# EAGLE design A704E (EAGLE 6.6.0)
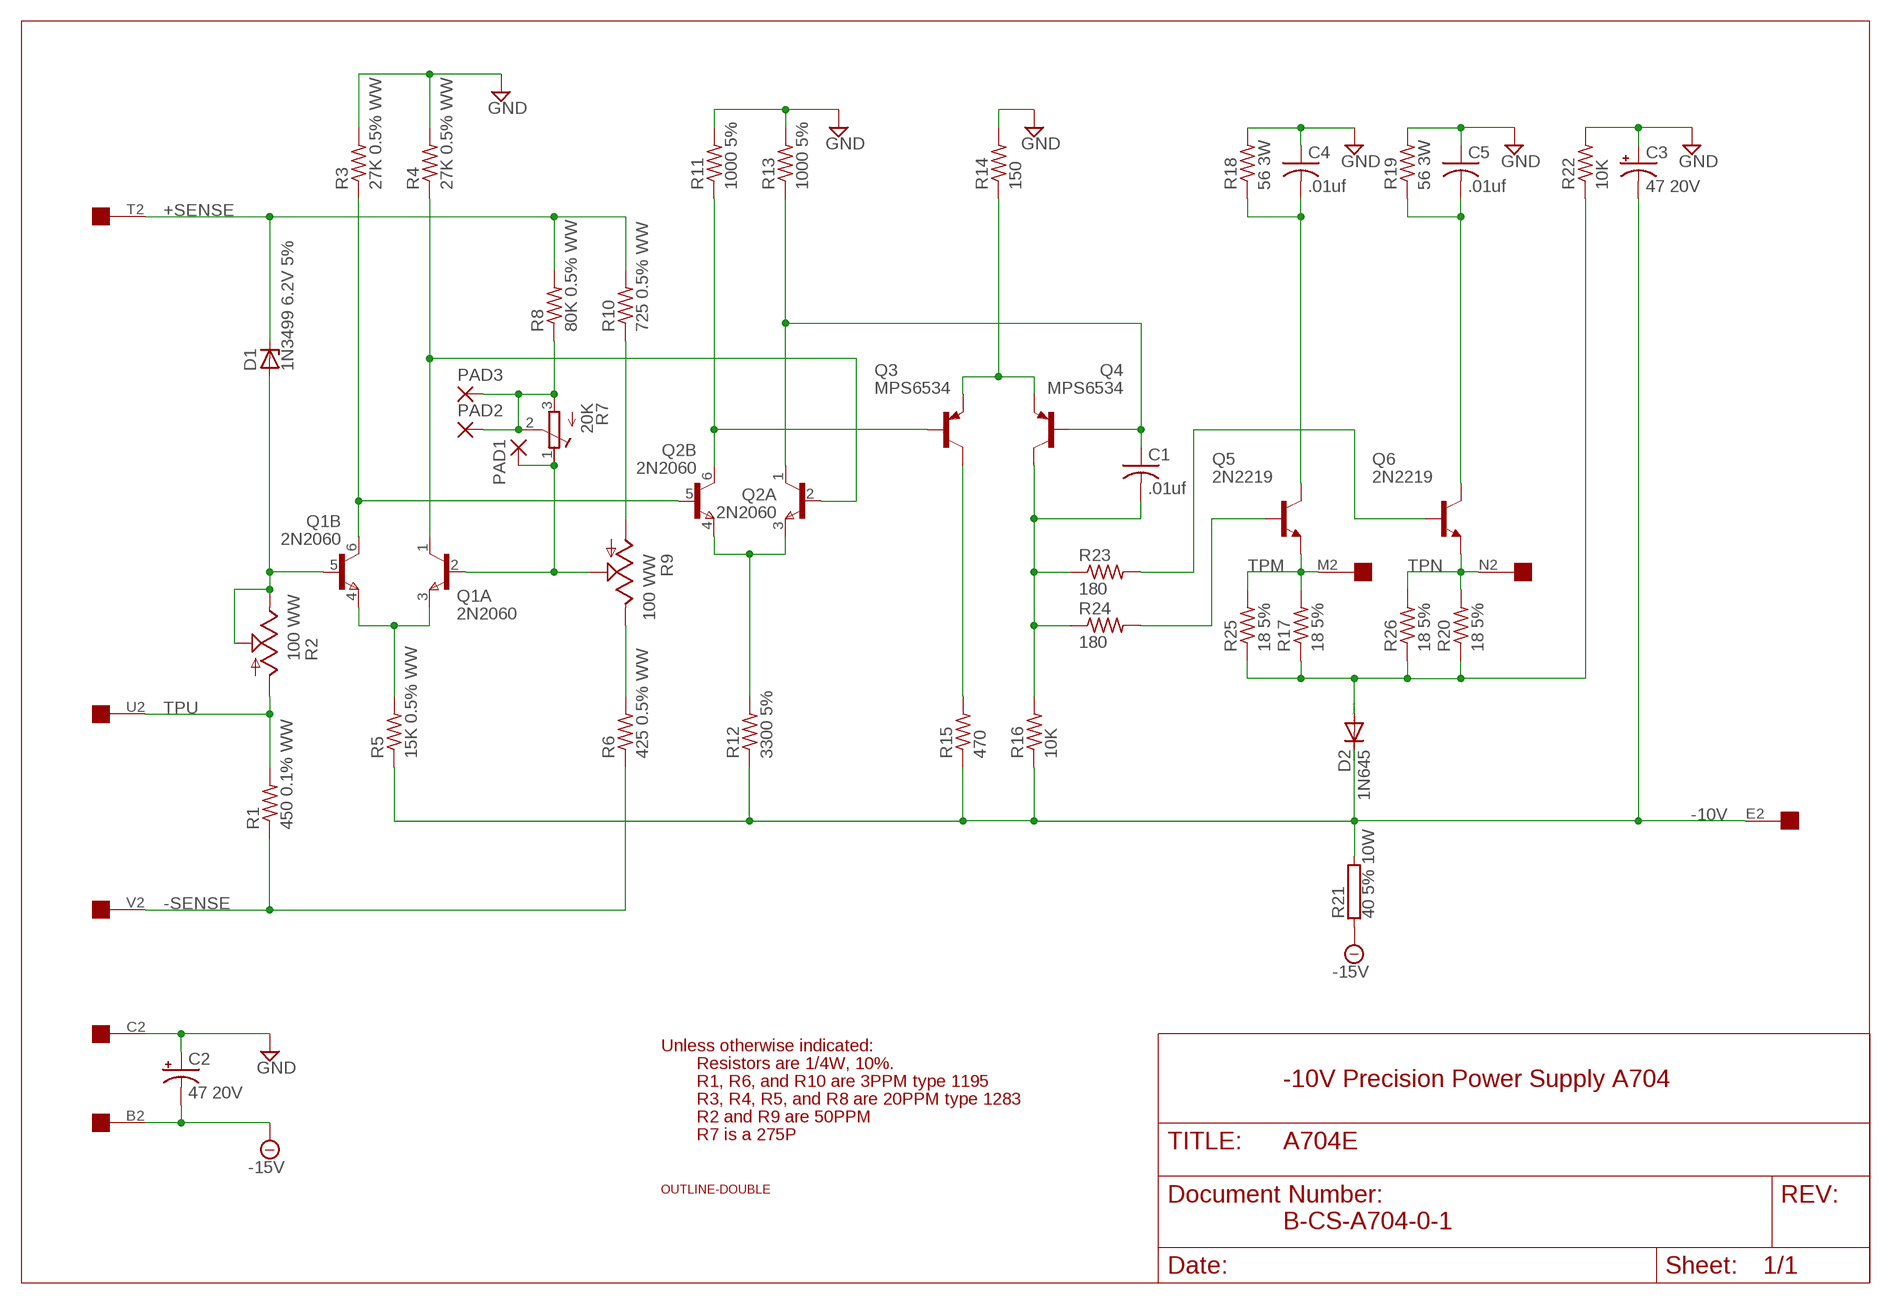
[diagram p0: schematic, sheet 1]

## Parts
C1  .01uf  C-US050-025X075  [C050-025X075]
C2  47 20V  CPOL-USE22-6AXIAL  [E22-6]
C3  47 20V  CPOL-USE22-6AXIAL  [E22-6]
C4  .01uf  C-US050-025X075  [C050-025X075]
C5  .01uf  C-US050-025X075  [C050-025X075]
D1  1N3499 6.2V 5%  ZENER-DIODEDO35Z10  [DO35Z10]
D2  1N645  1N4148DO35-10  [DO35-10]
PAD1  2,54/1,0  [2,54/1,0]
PAD2  2,54/1,0  [2,54/1,0]
PAD3  2,54/1,0  [2,54/1,0]
Q1  2N2060  MAT-02H  [TO78]
Q2  2N2060  MAT-02H  [TO78]
Q3  MPS6534  2N2904A  [TO39]
Q4  MPS6534  2N2904A  [TO39]
Q5  2N2219  2N1613-NPN-TO39-EBC  [TO39]
Q6  2N2219  2N1613-NPN-TO39-EBC  [TO39]
R1  450 0.1% WW  R-US_0817/22  [P0817/22]
R2  100 WW  TRIM_US-S75P  [S75P]
R3  27K 0.5% WW  R-US_0411/15  [0411/15]
R4  27K 0.5% WW  R-US_0411/15  [0411/15]
R5  15K 0.5% WW  R-US_0411/15  [0411/15]
R6  425 0.5% WW  R-US_0817/22  [P0817/22]
R7  20K  275P  [3006Y]
R8  80K 0.5% WW  R-US_0411/15  [0411/15]
R9  100 WW  TRIM_US-S75P  [S75P]
R10  725 0.5% WW  R-US_0817/22  [P0817/22]
R11  1000 5%  R-US_0207/10  [0207/10]
R12  3300 5%  R-US_0207/10  [0207/10]
R13  1000 5%  R-US_0207/10  [0207/10]
R14  150  R-US_0207/10  [0207/10]
R15  470  R-US_0207/10  [0207/10]
R16  10K  R-US_0207/10  [0207/10]
R17  18 5%  R-US_0207/10  [0207/10]
R18  56 3W  R-US_0411/15  [0411/15]
R19  56 3W  R-US_0411/15  [0411/15]
R20  18 5%  R-US_0207/10  [0207/10]
R21  40 5% 10W  RKH216-8  [KH216-8]
R22  10K  R-US_0207/10  [0207/10]
R23  180  R-US_0207/10  [0207/10]
R24  180  R-US_0207/10  [0207/10]
R25  18 5%  R-US_0207/10  [0207/10]
R26  18 5%  R-US_0207/10  [0207/10]
U$2  OUTLINE-DOUBLE  [DOUBLE]
U$3  EDGE-1  [EDGE-CON1]

## Nets
+SENSE: D1.C R8.2 R10.2 U$3.T2
-10V: C3.- D2.C R5.1 R12.1 R15.1 R16.1 R21.2 U$3.E2
-15V [supply]: C2.- R21.1 U$3.B2
-SENSE: R1.1 R6.1 U$3.V2
GND [supply]: C2.+ C3.+ C4.1 C5.1 R3.2 R4.2 R11.2 R13.2 R14.2 R18.2 R19.2 R22.2 U$3.C2
N$1: Q1.3(A:E) Q1.4(B:E) R5.2
N$2: Q1.1(A:C) Q2.2(A:B) R4.1
N$3: Q1.6(B:C) Q2.5(B:B) R3.1
N$4: D1.A Q1.5(B:B) R2.E R2.S
N$5: R6.2 R9.E
N$6: Q2.3(A:E) Q2.4(B:E) R12.2
N$7: Q2.6(B:C) Q3.2(B) R11.1
N$8: PAD1.1(P) Q1.2(A:B) R7.1(A) R9.S
N$10: C1.1 Q2.1(A:C) Q4.2(B) R13.1
N$11: Q3.3(C) R15.2
N$12: C1.2 Q4.3(C) R16.2 R23.1 R24.1
N$13: PAD2.1(P) PAD3.1(P) R7.2(S) R7.3(E) R8.1
N$15: D2.A R17.1 R20.1 R22.1 R25.1 R26.1
N$17: Q3.1(E) Q4.1(E) R14.1
N$18: Q5.2(B) R24.2
N$19: Q6.2(B) R23.2
N$20: C4.2 Q5.3(C) R18.1
N$21: C5.2 Q6.3(C) R19.1
N$22: R9.A R10.1
TPM: Q5.1(E) R17.2 R25.2 U$3.M2
TPN: Q6.1(E) R20.2 R26.2 U$3.N2
TPU: R1.2 R2.A U$3.U2
Unconnected: U$3.A2 U$3.D2 U$3.F2 U$3.H2 U$3.J2 U$3.K2 U$3.L2 U$3.P2 U$3.R2 U$3.S2

## Notes on the sheet
- Unless otherwise indicated:
- Resistors are 1/4W, 10%.
- R1, R6, and R10 are 3PPM type 1195 | -10V Precision Power Supply A704
- R3, R4, R5, and R8 are 20PPM type 1283
- R2 and R9 are 50PPM
- R7 is a 275P
- B-CS-A704-0-1

## Library data of the parts
C1 C4 C5 = rcl:C-US: CAPACITOR, American symbol
C2 C3 = rcl:CPOL-US: POLARIZED CAPACITOR, American symbol
D1 = diode:ZENER-DIODE: Z-Diode
D2 = diode:1N4148: DIODE high speed (Philips)
PAD1-PAD3 = wirepad:2,54/1,0: THROUGH-HOLE PAD
Q1 Q2 = linear:MAT-02H: Dual TRANSISTOR
Q3 Q4 = transistor-pnp:2N2904*: PNP Transistror
Q5 Q6 = transistor:*-NPN-: NPN Transistror BF959 corrected 2008.03.06
R1 R3-R6 R8 R10-R20 R22-R26 = rcl:R-US_: RESISTOR, American symbol
R2 R9 = pot:TRIM_US-: POTENTIOMETER
R7 = dec-con:275P: Trimpot with 275P (3006Y) footprint.
R21 = resistor-power:R: Power Resitor; OC_FARNELL: unknown; OC_NEWARK: unknown
U$2 = dec-con:OUTLINE-*: Board outlines for DEC boards.
U$3 = dec-con:EDGE-1: Single-Sided DEC Edge Connector -- (side 2)

## Net classes
1 supply: width 0.813 mm

## Board
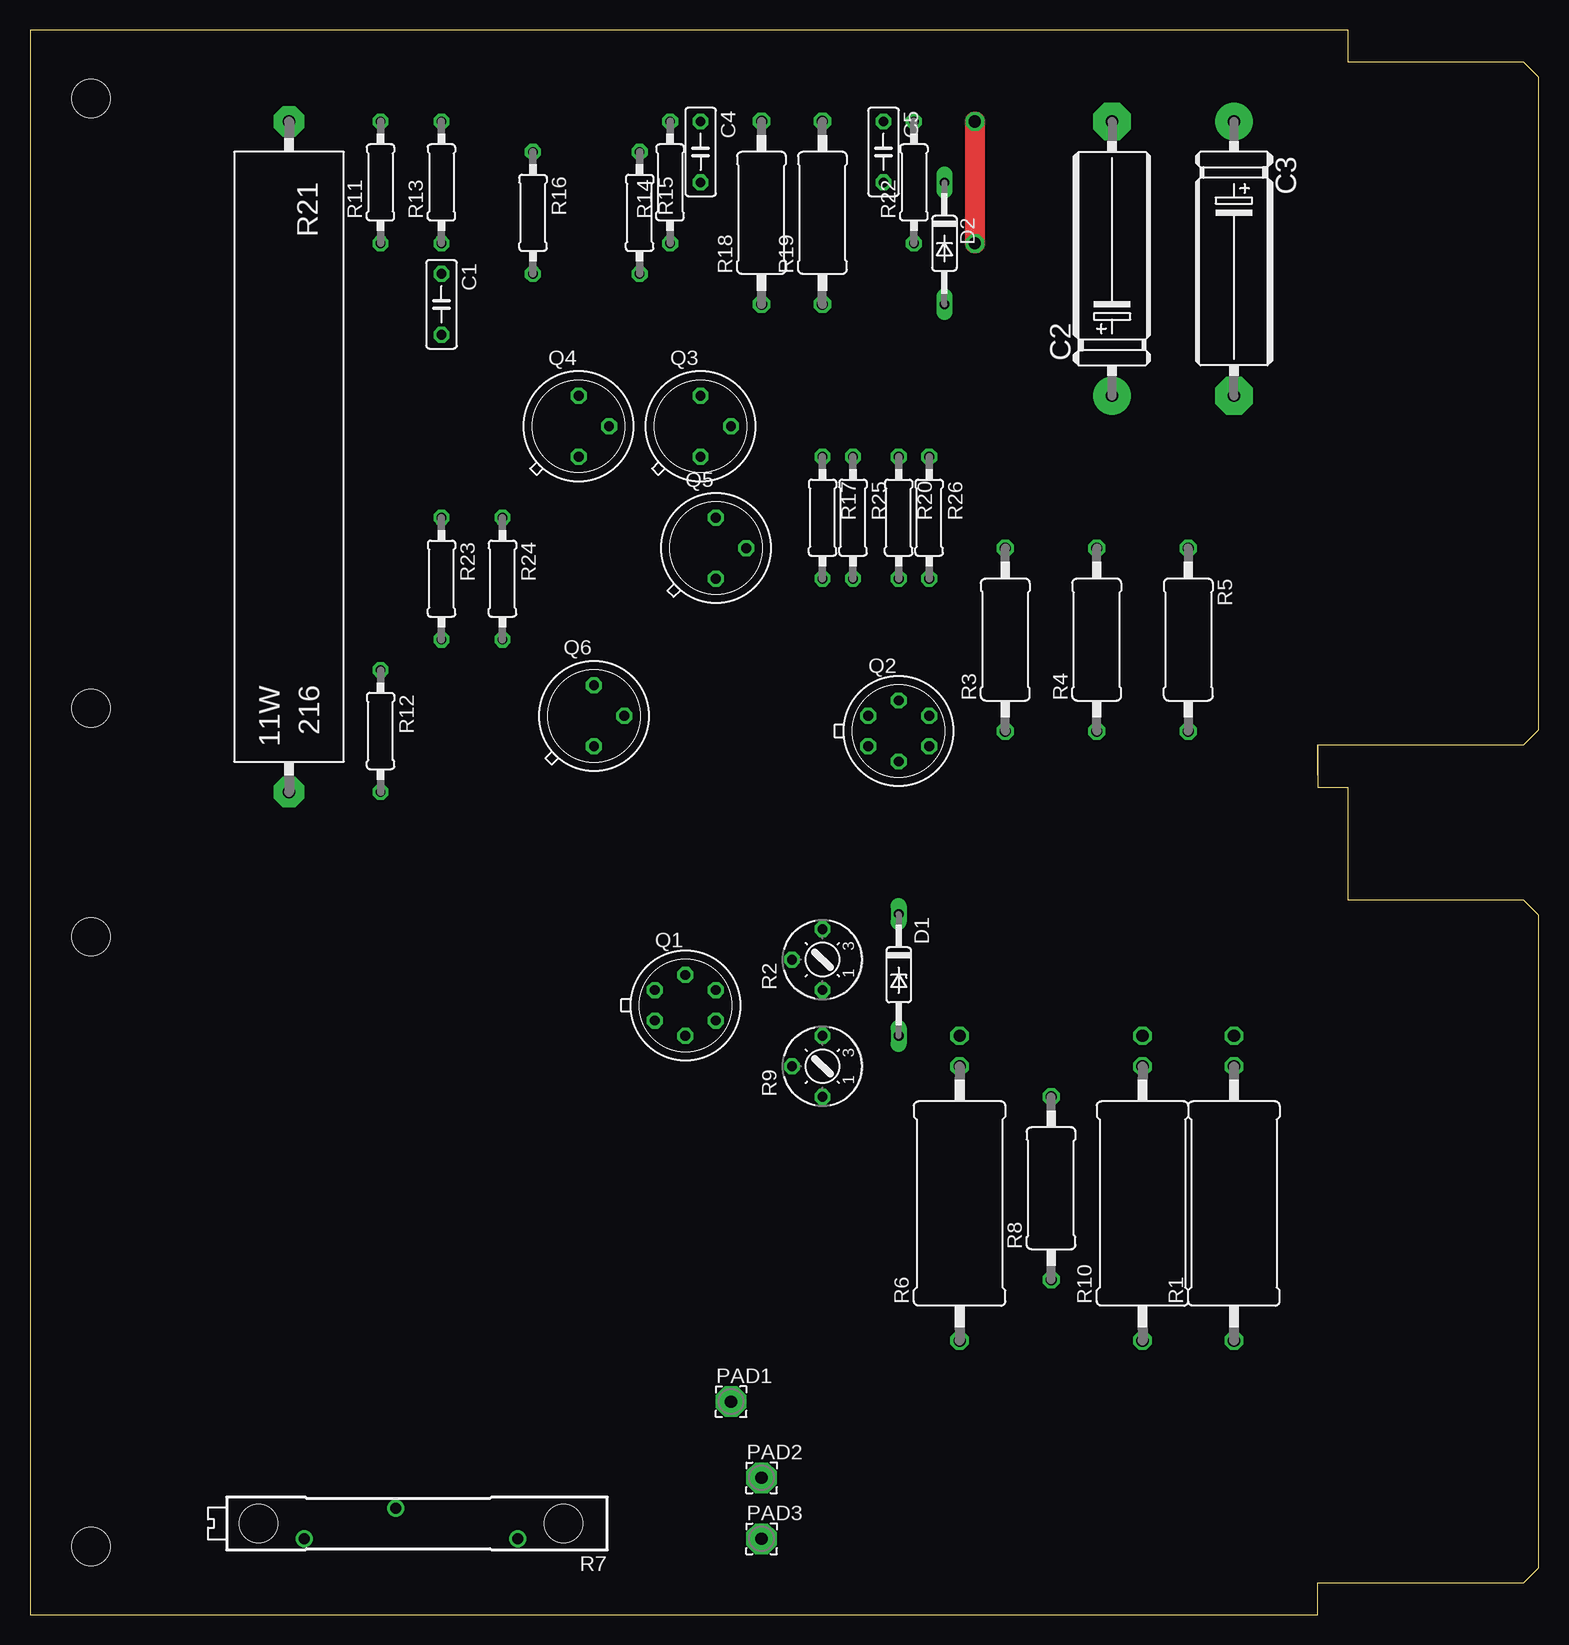
[diagram p1: board, top side]
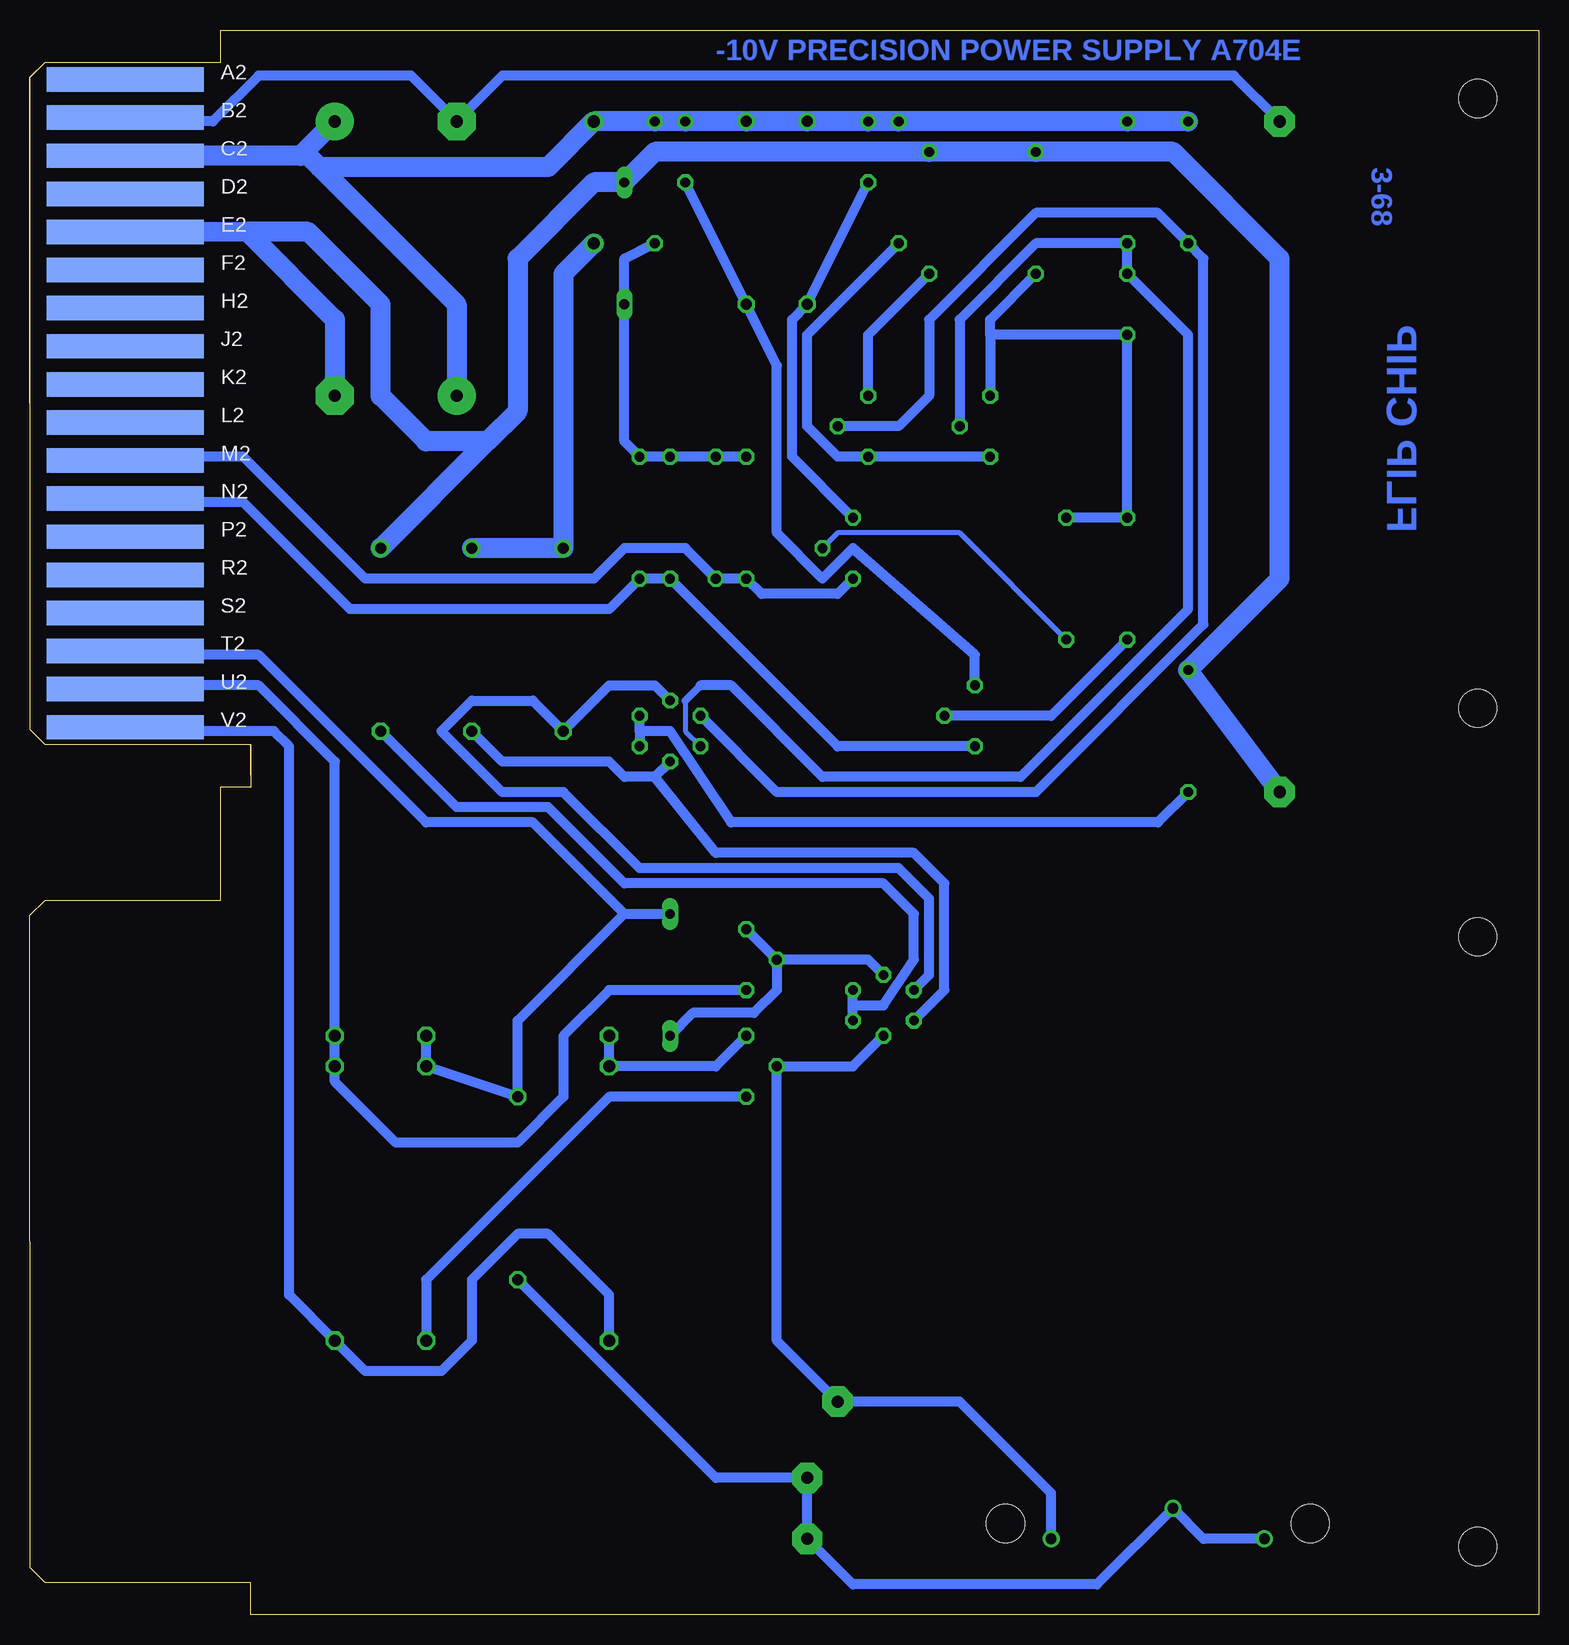
[diagram p2: board, bottom side, seen from below]

Size 125.73 x 132.08 mm. Coordinates in mm from the lower left corner, seen from the top.
Copper layers (1+16): Top 0.035mm / dielectric 1.5mm / Bottom 0.035mm
Design rules "16mils": minimum track width 16mil, minimum drill 32mil, track to track 15mil, track to pad 10mil, pad to pad 10mil, via to via 10mil, smd to smd 10mil, copper to edge 13mil, drill to drill 10mil, minimum pad ring 10mil, minimum via ring 8mil, stop-mask expansion 0mil, vias tented up to drill 0mil, thermal gap 10mil
Holes 3.17 mm at 19.05,7.62 44.45,7.62

### Footprints (pad centres in the part's own frame; a part is rotated, then mirrored left to right if it is on the bottom)
C050-025X075 = drill 0.813 octagon: 1 -2.54,0; 2 2.54,0
E22-6 = drill 1.016 pad 3.15: + -11.43,0 | drill 1.016 pad 3.15 octagon: - 11.43,0
DO35Z10 = drill 0.813 long: A 5.08,0; C -5.08,0
DO35-10 = drill 0.813 long: A 5.08,0; C -5.08,0
2,54/1,0 = drill 1.016 pad 2.54 octagon: 1 0,0
TO78 = drill 0.813 octagon: 1 -2.54,-1.27; 2 0,-2.54; 3 2.54,-1.27; 4 2.54,1.27; 5 0,2.54; 6 -2.54,1.27
TO39 = drill 0.813 octagon: 1 0,-2.54; 2 2.54,0; 3 0,2.54
P0817/22 = drill 1.016 octagon: 1 -11.43,0; 2 11.43,0
S75P = drill 0.813 octagon: A -2.54,0; E 2.54,0; S 0,2.54
0411/15 = drill 0.914 octagon: 1 -7.62,0; 2 7.62,0
3006Y = drill 0.9: 1 -8.89,1.27; 2 1.27,-1.27; 3 8.89,1.27
0207/10 = drill 0.813 octagon: 1 -5.08,0; 2 5.08,0
KH216-8 = drill 1.016 pad 2.54 octagon: 1 -27.94,0; 2 27.94,0
DOUBLE = hole 3.175: 120.65,56.515; 120.65,5.715; 120.65,75.565; 120.65,126.365
EDGE-CON1 = smd 13.106 x 2.032 bottom: A2 7.938,4.128; B2 7.938,7.303; C2 7.938,10.477; D2 7.938,13.652; E2 7.938,16.828; F2 7.938,20.003; H2 7.938,23.177; J2 7.938,26.352; K2 7.938,29.527; L2 7.938,32.703; M2 7.938,35.877; N2 7.938,39.053; P2 7.938,42.227; R2 7.938,45.403; S2 7.938,48.578; T2 7.938,51.752; U2 7.938,54.928; V2 7.938,58.102

### Placement (x,y rotation side)
C1  34.29,109.22 270 top
C2  90.17,113.03 90 top
C3  100.33,113.03 270 top
C4  55.88,121.92 270 top
C5  71.12,121.92 270 top
D1  72.39,53.34 270 top
D2  76.2,114.3 270 top
PAD1  58.42,17.78 0 top
PAD2  60.96,11.43 0 top
PAD3  60.96,6.35 0 top
Q1  54.61,50.8 0 top
Q2  72.39,73.66 0 top
Q3  55.88,99.06 0 top
Q4  45.72,99.06 0 top
Q5  57.15,88.9 0 top
Q6  46.99,74.93 0 top
R1  100.33,34.29 90 top
R2  66.04,54.61 90 top
R3  81.28,81.28 90 top
R4  88.9,81.28 90 top
R5  96.52,81.28 270 top
R6  77.47,34.29 90 top
R7  31.75,7.62 180 top
R8  85.09,35.56 90 top
R9  66.04,45.72 90 top
R10  92.71,34.29 90 top
R11  29.21,119.38 90 top
R12  29.21,73.66 270 top
R13  34.29,119.38 90 top
R14  53.34,119.38 90 top
R15  50.8,116.84 270 top
R16  41.91,116.84 270 top
R17  66.04,91.44 270 top
R18  60.96,116.84 90 top
R19  66.04,116.84 90 top
R20  72.39,91.44 270 top
R21  21.59,96.52 270 top
R22  73.66,119.38 90 top
R23  34.29,86.36 270 top
R24  39.37,86.36 270 top
R25  68.58,91.44 270 top
R26  74.93,91.44 270 top
U$2  125.73,132.08 180 top
U$3  125.73,132.08 180 top

### Tracks (layer width: path | path; a pad name or v marks a point on that pad's centre or on a via)
+SENSE  (via drill 1.02)
  Bottom 0.813: v92.71,48.26 R10.2 R8.2 85.09,49.53 76.2,58.42 | 76.2,58.42 D1.C | U$3.T2 115.9,80.34 115.57,80.01 106.68,80.01 92.71,66.04 83.82,66.04 76.2,58.42
-10V
  Bottom 1.676: U$3.E2 107.62,115.24 107.63,115.25 | 107.63,115.25 100.33,107.95 C3.- | 107.63,115.25 102.55,115.25 96.52,109.22 96.52,101.6 92.71,97.79 87.63,97.79 | 87.63,97.79 85.09,100.33 85.09,113.03 78.74,119.38 D2.C 73.66,121.92 R15.1 R16.1 30.48,121.92 21.59,113.03 21.59,86.36 R12.1 R21.2 | 87.63,97.79 R5.1
-15V
  Bottom 0.813: U$3.B2 116.84,124.75 116.84,124.46 110.49,124.46 106.68,128.27 93.98,128.27 C2.- 86.36,128.27 25.4,128.27 R21.1
-SENSE
  Bottom 0.813: U$3.V2 117.16,73.98 116.84,73.66 105.41,73.66 104.14,72.39 104.14,26.67 R1.1 97.79,20.32 91.44,20.32 88.9,22.86 88.9,27.94 85.09,31.75 82.55,31.75 77.47,26.67 R6.1
GND  (via drill 1.02)
  Top 1.676: v78.74,124.46 v78.74,114.3
  Bottom 1.676: U$3.C2 103.2,121.59 102.87,121.92 | 102.87,121.92 C3.+ | 101.6,120.65 102.87,121.92 | 101.6,120.65 82.55,120.65 v78.74,124.46 R22.2 C5.1 R19.2 R18.2 C4.1 R14.2 R13.2 R11.2 | C2.+ 90.17,109.22 101.6,120.65 | R4.2 R3.2 81.28,111.76 v78.74,114.3
N$1
  Bottom 0.813: Q1.3 57.15,50.8 | 57.15,50.8 Q1.4 | 57.15,50.8 54.61,50.8 52.07,54.61 52.07,58.42 54.61,60.96 76.2,60.96 82.55,67.31 90.17,67.31 R5.2
N$2
  Bottom 0.813: 73.66,69.85 Q2.2 | 73.66,69.85 76.2,69.85 77.47,71.12 86.36,71.12 R4.1 | 73.66,69.85 68.58,63.5 52.07,63.5 49.53,60.96 49.53,52.07 Q1.1
N$3
  Bottom 0.813: Q2.5 73.66,77.47 77.47,77.47 R3.1 83.82,76.2 88.9,76.2 91.44,73.66 86.36,68.58 81.28,68.58 74.93,62.23 53.34,62.23 50.8,59.69 50.8,53.34 Q1.6
N$4
  Bottom 0.813: R2.S R2.E | Q1.5 55.88,54.61 R2.S | D1.A 70.48,50.16 65.41,50.16 63.5,52.07 R2.S
N$5  (via drill 1.02)
  Bottom 0.813: v77.47,48.26 R6.2 68.58,45.72 R9.E
N$6
  Bottom 0.813: 74.93,73.66 Q2.4 | 74.93,73.66 Q2.3 | 74.93,73.66 72.39,73.66 67.31,66.04 31.75,66.04 R12.2
N$7
  Bottom 0.813: Q2.6 63.5,68.58 41.91,68.58 27.94,82.55 27.94,113.03 R11.1 31.75,116.84 41.91,116.84 50.8,107.95 50.8,101.6 53.34,99.06 Q3.2
N$8
  Bottom 0.813: R7.1 40.64,10.16 48.26,17.78 PAD1.1 63.5,22.86 R9.S 57.15,45.72 Q1.2
N$10
  Bottom 0.406: Q2.1 71.12,73.66 71.12,76.2
  Bottom 0.61: 69.85,77.47 71.12,76.2
  Bottom 0.813: Q4.2 48.26,107.95 41.91,114.3 R13.1 C1.1 29.21,106.68 29.21,83.82 43.18,69.85 59.69,69.85 67.31,77.47 69.85,77.47
N$11
  Bottom 0.813: Q3.3 55.88,106.68 R15.2
N$12
  Bottom 0.813: R24.1 R23.1 C1.2 45.72,106.68 | R16.2 45.72,107.95 45.72,106.68 | 45.72,106.68 Q4.3
N$13
  Bottom 0.813: R7.3 27.94,6.35 R7.2 36.83,2.54 57.15,2.54 PAD3.1 PAD2.1 68.58,11.43 R8.1
N$15
  Bottom 0.813: R22.1 76.2,113.03 D2.A 76.2,97.79 R26.1 R20.1 R25.1 R17.1
N$17
  Bottom 0.813: Q4.1 Q3.1 58.42,96.52 60.96,99.06 60.96,106.68 R14.1
N$18
  Bottom 0.406: Q5.2 58.42,90.17 48.26,90.17 R24.2
N$19
  Bottom 0.813: Q6.2 40.64,74.93 R23.2
N$20
  Bottom 0.813: C4.2 R18.1 62.23,107.95 62.23,96.52 Q5.3
N$21
  Bottom 0.813: C5.2 R19.1 63.5,104.14 63.5,90.17 59.69,86.36 57.15,88.9 46.99,80.01 Q6.3
N$22
  Bottom 0.813: R9.A 77.47,43.18 92.71,27.94 R10.1
TPM
  Bottom 0.813: U$3.M2 117.17,96.19 116.84,96.52 107.95,96.52 97.79,86.36 78.74,86.36 76.2,88.9 71.12,88.9 R25.2 R17.2 64.77,85.09 58.42,85.09 Q5.1
TPN
  Bottom 0.813: U$3.N2 117.17,93.04 116.84,92.71 107.95,92.71 99.06,83.82 77.47,83.82 R26.2 R20.2 58.42,72.39 Q6.1
TPU  (via drill 1.02)
  Bottom 0.813: U$3.U2 117.2,77.11 116.84,77.47 106.68,77.47 100.33,71.12 v100.33,48.26 R1.2 100.33,44.45 95.25,39.37 85.09,39.37 81.28,43.18 81.28,48.26 77.47,52.07 R2.A

### Text on the board
Bottom: -10V PRECISION POWER SUPPLY A704E | 3-68 | FLIP CHIP